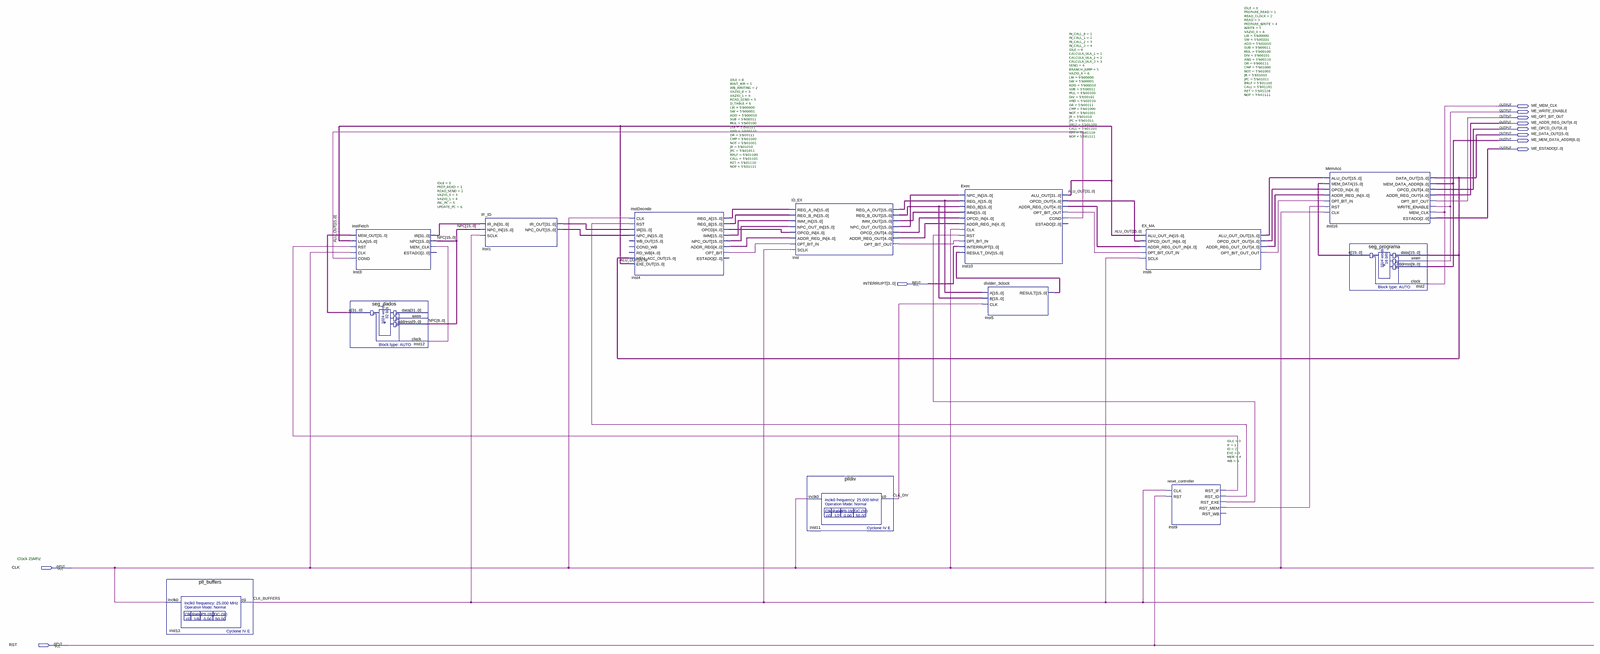
[diagram p0: schematic sheet, whole]
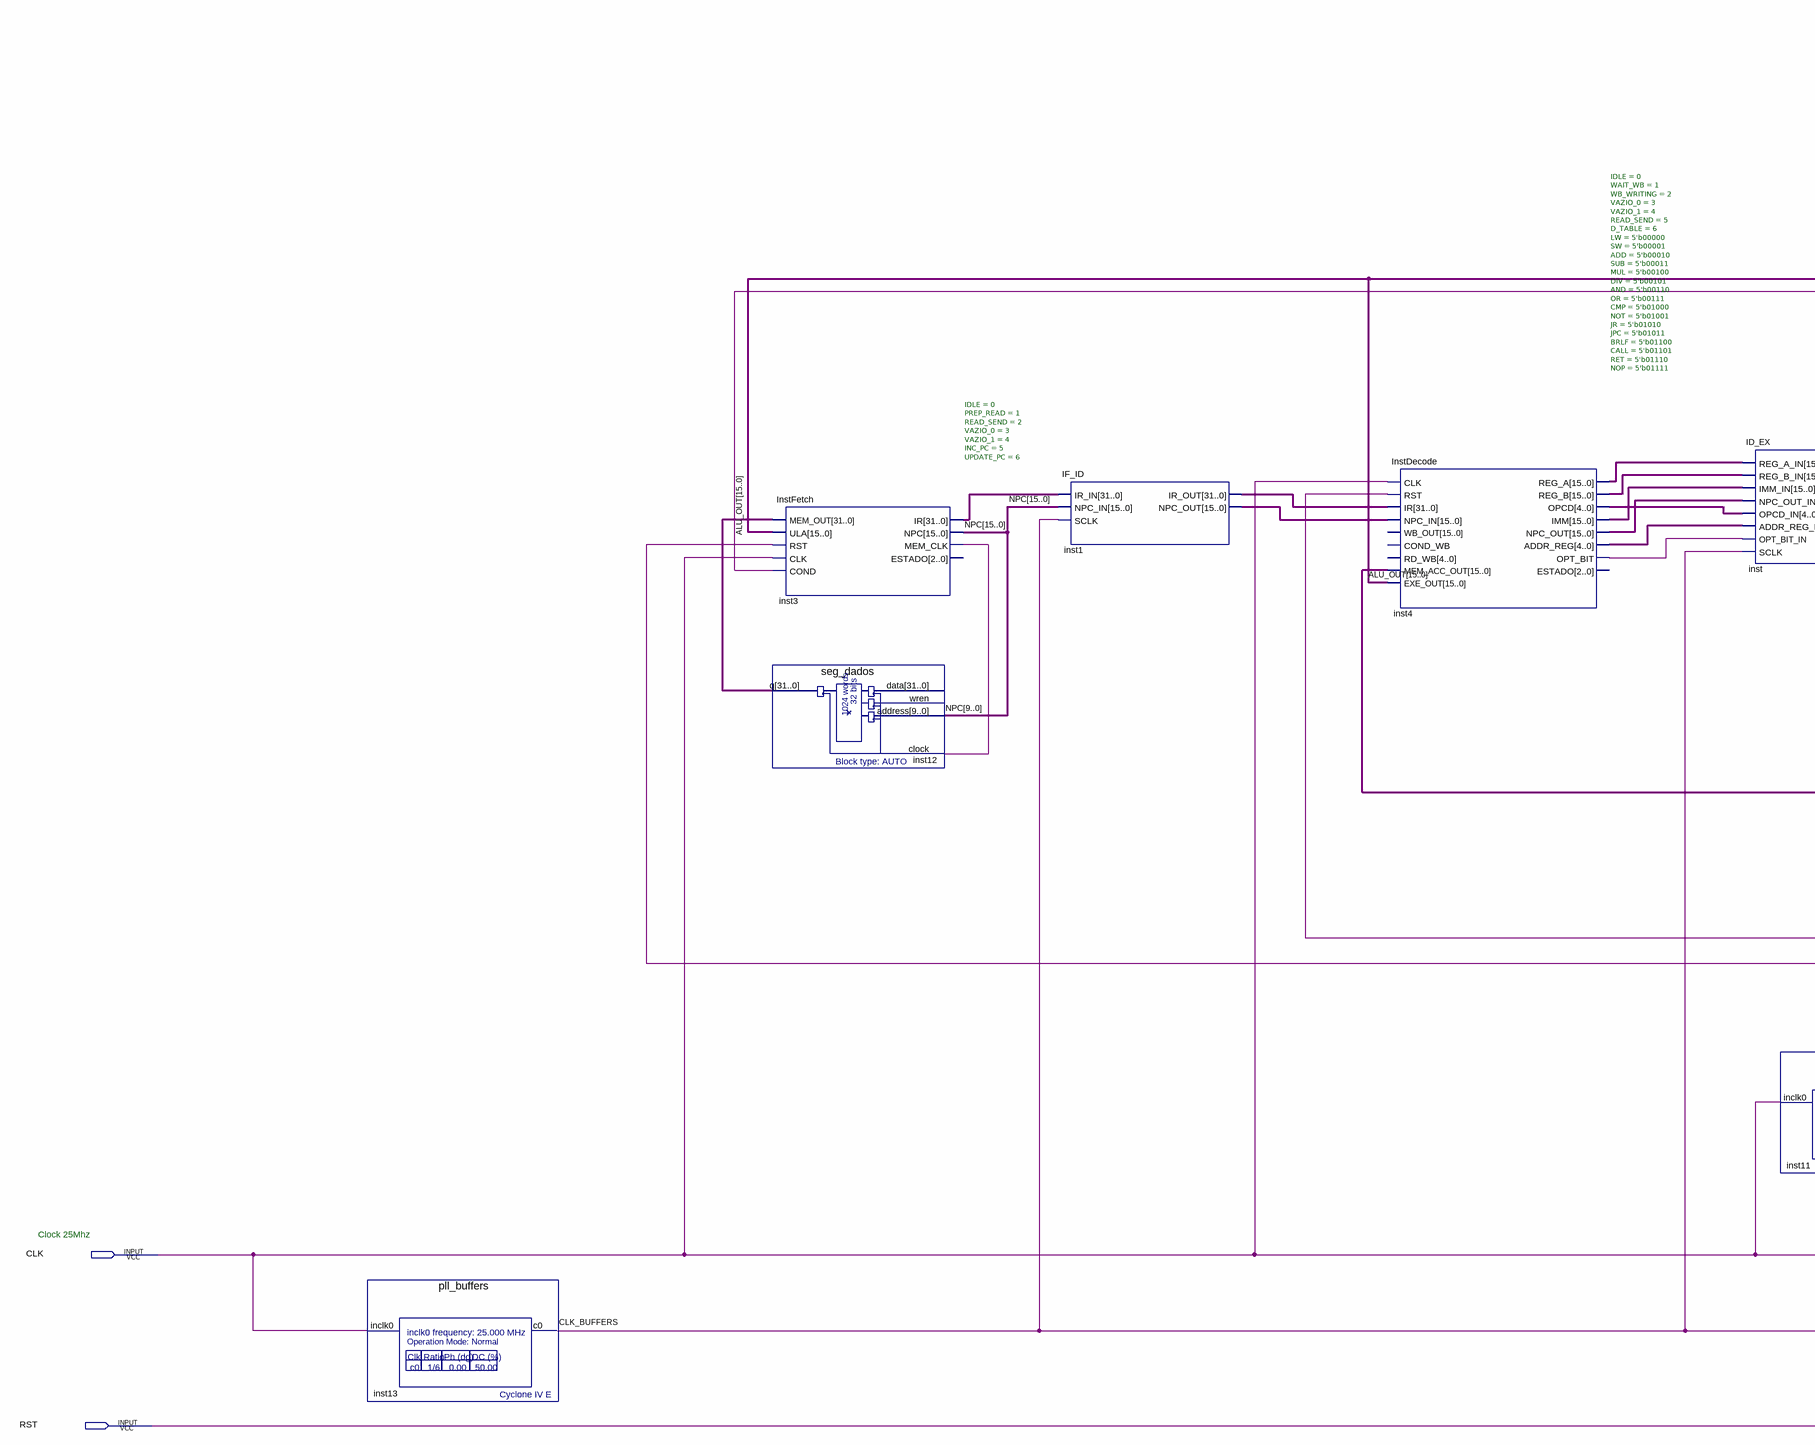
[diagram p1: schematic sheet, left part]
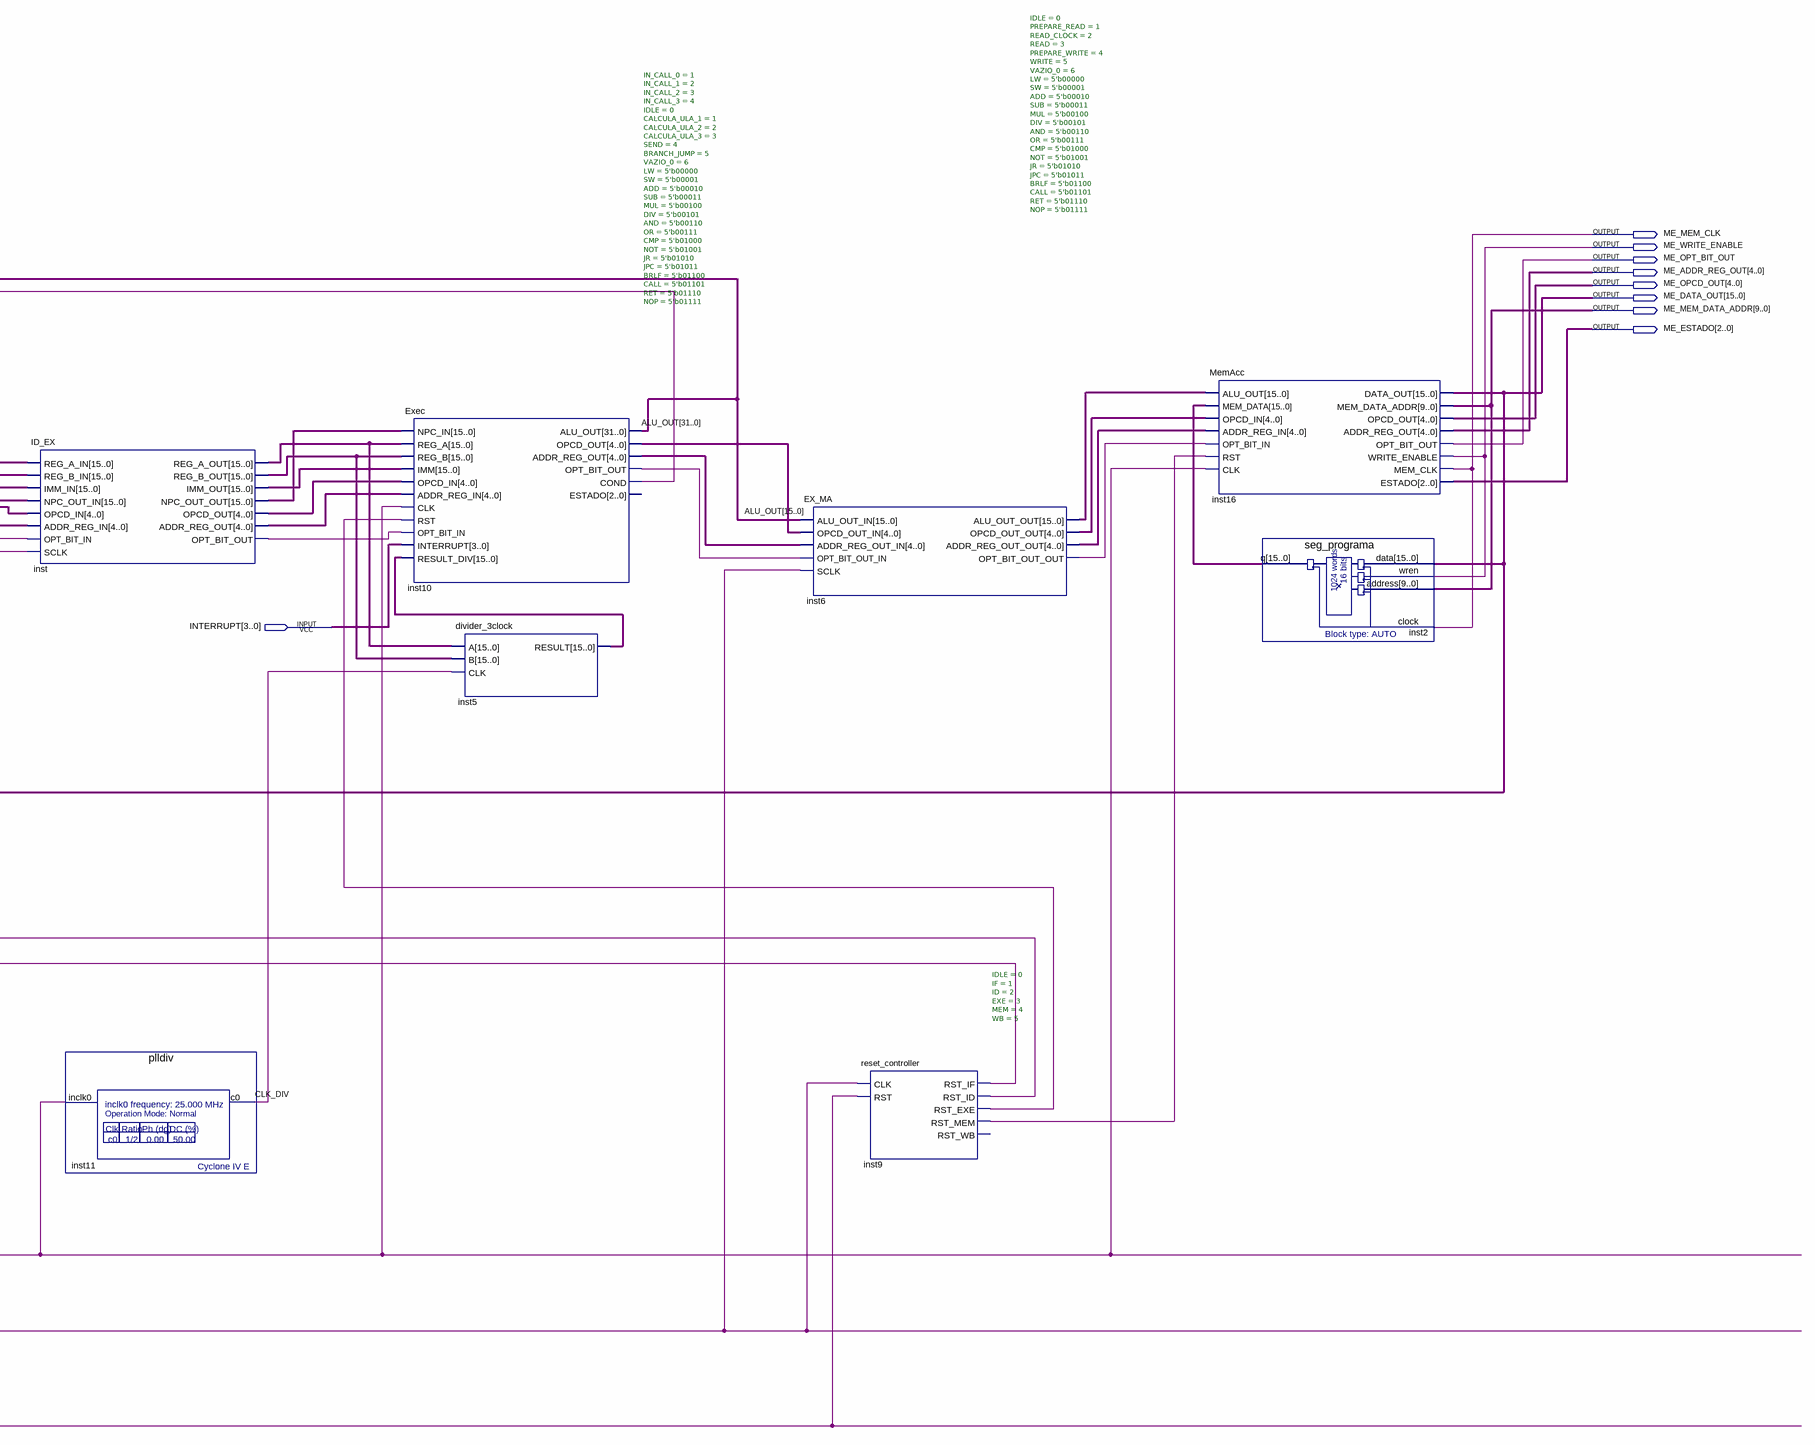
[diagram p2: schematic sheet, right part]
// Quartus schematic MemAcc_block_.bdf as structural Verilog: 13 symbols, 11 pins
module MemAcc_block_ (
  input  [3:0] INTERRUPT,
  input  CLK,
  input  RST,
  output ME_MEM_CLK,
  output ME_WRITE_ENABLE,
  output ME_OPT_BIT_OUT,
  output [4:0] ME_ADDR_REG_OUT,
  output [4:0] ME_OPCD_OUT,
  output [15:0] ME_DATA_OUT,
  output [9:0] ME_MEM_DATA_ADDR,
  output [2:0] ME_ESTADO
);

  wire CLK_BUFFERS, CLK_DIV, inst3_mem_clk, inst4_opt_bit, inst6_opt_bit_out_out, inst9_rst_exe,
       inst9_rst_id, inst9_rst_if, inst9_rst_mem, inst10_cond, inst10_opt_bit_out, inst_opt_bit_out;
  wire [4:0] inst4_addr_reg, inst4_opcd, inst6_addr_reg_out_out, inst6_opcd_out_out, inst10_addr_reg_out,
       inst10_opcd_out, inst_addr_reg_out, inst_opcd_out;
  wire [15:0] inst1_npc_out, inst2_q, inst4_imm, inst4_npc_out, inst4_reg_a, inst4_reg_b, inst5_result,
       inst6_alu_out_out, inst_imm_out, inst_npc_out_out, inst_reg_a_out, inst_reg_b_out, NPC;
  wire [31:0] ALU_OUT, inst1_ir_out, inst3_ir, inst12_q;

  pll_buffers inst13 (.inclk0(CLK), .c0(CLK_BUFFERS));
  InstFetch #(.IDLE(0), .PREP_READ(1), .READ_SEND(2), .VAZIO_0(3), .VAZIO_1(4), .INC_PC(5), .UPDATE_PC(6)) inst3 (
    .MEM_OUT(inst12_q), .ULA(ALU_OUT[15:0]), .RST(inst9_rst_if), .CLK(CLK), .COND(inst10_cond),
    .IR(inst3_ir), .NPC(NPC), .MEM_CLK(inst3_mem_clk));  // open: ESTADO
  seg_dados inst12 (.address(NPC[9:0]), .clock(inst3_mem_clk), .q(inst12_q));  // open: data, wren
  IF_ID inst1 (.IR_IN(inst3_ir), .NPC_IN(NPC), .SCLK(CLK_BUFFERS), .IR_OUT(inst1_ir_out), .NPC_OUT(inst1_npc_out));
  InstDecode #(.IDLE(0), .WAIT_WB(1), .WB_WRITING(2), .VAZIO_0(3), .VAZIO_1(4), .READ_SEND(5), .D_TABLE(6), .LW(5'b00000), .SW(5'b00001), .ADD(5'b00010), .SUB(5'b00011), .MUL(5'b00100), .DIV(5'b00101), .AND(5'b00110), .OR(5'b00111), .CMP(5'b01000), .NOT(5'b01001), .JR(5'b01010), .JPC(5'b01011), .BRLF(5'b01100), .CALL(5'b01101), .RET(5'b01110), .NOP(5'b01111)) inst4 (
    .CLK(CLK), .RST(inst9_rst_id), .IR(inst1_ir_out), .NPC_IN(inst1_npc_out), .MEM_ACC_OUT(ME_DATA_OUT),
    .EXE_OUT(ALU_OUT[15:0]), .REG_A(inst4_reg_a), .REG_B(inst4_reg_b), .OPCD(inst4_opcd), .IMM(inst4_imm),
    .NPC_OUT(inst4_npc_out), .ADDR_REG(inst4_addr_reg), .OPT_BIT(inst4_opt_bit));  // open: WB_OUT, COND_WB, RD_WB, ESTADO
  ID_EX inst (
    .REG_A_IN(inst4_reg_a), .REG_B_IN(inst4_reg_b), .IMM_IN(inst4_imm), .NPC_OUT_IN(inst4_npc_out),
    .OPCD_IN(inst4_opcd), .ADDR_REG_IN(inst4_addr_reg), .OPT_BIT_IN(inst4_opt_bit), .SCLK(CLK_BUFFERS),
    .REG_A_OUT(inst_reg_a_out), .REG_B_OUT(inst_reg_b_out), .IMM_OUT(inst_imm_out),
    .NPC_OUT_OUT(inst_npc_out_out), .OPCD_OUT(inst_opcd_out), .ADDR_REG_OUT(inst_addr_reg_out),
    .OPT_BIT_OUT(inst_opt_bit_out));
  plldiv inst11 (.inclk0(CLK), .c0(CLK_DIV));
  Exec #(.IN_CALL_0(1), .IN_CALL_1(2), .IN_CALL_2(3), .IN_CALL_3(4), .IDLE(0), .CALCULA_ULA_1(1), .CALCULA_ULA_2(2), .CALCULA_ULA_3(3), .SEND(4), .BRANCH_JUMP(5), .VAZIO_0(6), .LW(5'b00000), .SW(5'b00001), .ADD(5'b00010), .SUB(5'b00011), .MUL(5'b00100), .DIV(5'b00101), .AND(5'b00110), .OR(5'b00111), .CMP(5'b01000), .NOT(5'b01001), .JR(5'b01010), .JPC(5'b01011), .BRLF(5'b01100), .CALL(5'b01101), .RET(5'b01110), .NOP(5'b01111)) inst10 (
    .NPC_IN(inst_npc_out_out), .REG_A(inst_reg_a_out), .REG_B(inst_reg_b_out), .IMM(inst_imm_out),
    .OPCD_IN(inst_opcd_out), .ADDR_REG_IN(inst_addr_reg_out), .CLK(CLK), .RST(inst9_rst_exe),
    .OPT_BIT_IN(inst_opt_bit_out), .INTERRUPT(INTERRUPT), .RESULT_DIV(inst5_result), .ALU_OUT(ALU_OUT),
    .OPCD_OUT(inst10_opcd_out), .ADDR_REG_OUT(inst10_addr_reg_out), .OPT_BIT_OUT(inst10_opt_bit_out),
    .COND(inst10_cond));  // open: ESTADO
  divider_3clock inst5 (.A(inst_reg_a_out), .B(inst_reg_b_out), .CLK(CLK_DIV), .RESULT(inst5_result));
  EX_MA inst6 (
    .ALU_OUT_IN(ALU_OUT[15:0]), .OPCD_OUT_IN(inst10_opcd_out), .ADDR_REG_OUT_IN(inst10_addr_reg_out),
    .OPT_BIT_OUT_IN(inst10_opt_bit_out), .SCLK(CLK_BUFFERS), .ALU_OUT_OUT(inst6_alu_out_out),
    .OPCD_OUT_OUT(inst6_opcd_out_out), .ADDR_REG_OUT_OUT(inst6_addr_reg_out_out),
    .OPT_BIT_OUT_OUT(inst6_opt_bit_out_out));
  reset_controller #(.IDLE(0), .IF(1), .ID(2), .EXE(3), .MEM(4), .WB(5)) inst9 (
    .CLK(CLK_BUFFERS), .RST(RST), .RST_IF(inst9_rst_if), .RST_ID(inst9_rst_id), .RST_EXE(inst9_rst_exe),
    .RST_MEM(inst9_rst_mem));  // open: RST_WB
  MemAcc #(.IDLE(0), .PREPARE_READ(1), .READ_CLOCK(2), .READ(3), .PREPARE_WRITE(4), .WRITE(5), .VAZIO_0(6), .LW(5'b00000), .SW(5'b00001), .ADD(5'b00010), .SUB(5'b00011), .MUL(5'b00100), .DIV(5'b00101), .AND(5'b00110), .OR(5'b00111), .CMP(5'b01000), .NOT(5'b01001), .JR(5'b01010), .JPC(5'b01011), .BRLF(5'b01100), .CALL(5'b01101), .RET(5'b01110), .NOP(5'b01111)) inst16 (
    .ALU_OUT(inst6_alu_out_out), .MEM_DATA(inst2_q), .OPCD_IN(inst6_opcd_out_out),
    .ADDR_REG_IN(inst6_addr_reg_out_out), .OPT_BIT_IN(inst6_opt_bit_out_out), .RST(inst9_rst_mem), .CLK(CLK),
    .DATA_OUT(ME_DATA_OUT), .MEM_DATA_ADDR(ME_MEM_DATA_ADDR), .OPCD_OUT(ME_OPCD_OUT),
    .ADDR_REG_OUT(ME_ADDR_REG_OUT), .OPT_BIT_OUT(ME_OPT_BIT_OUT), .WRITE_ENABLE(ME_WRITE_ENABLE),
    .MEM_CLK(ME_MEM_CLK), .ESTADO(ME_ESTADO));
  seg_programa inst2 (
    .data(ME_DATA_OUT), .wren(ME_WRITE_ENABLE), .address(ME_MEM_DATA_ADDR), .clock(ME_MEM_CLK), .q(inst2_q));

  // Notes on the sheet:
  //   Clock 25Mhz
endmodule
